# Altium schematic sheet FPGA.SchDoc: =DocumentName
size A4; DocumentNumber: 1; Revision: 0; SheetNumber: 14; SheetTotal: 18
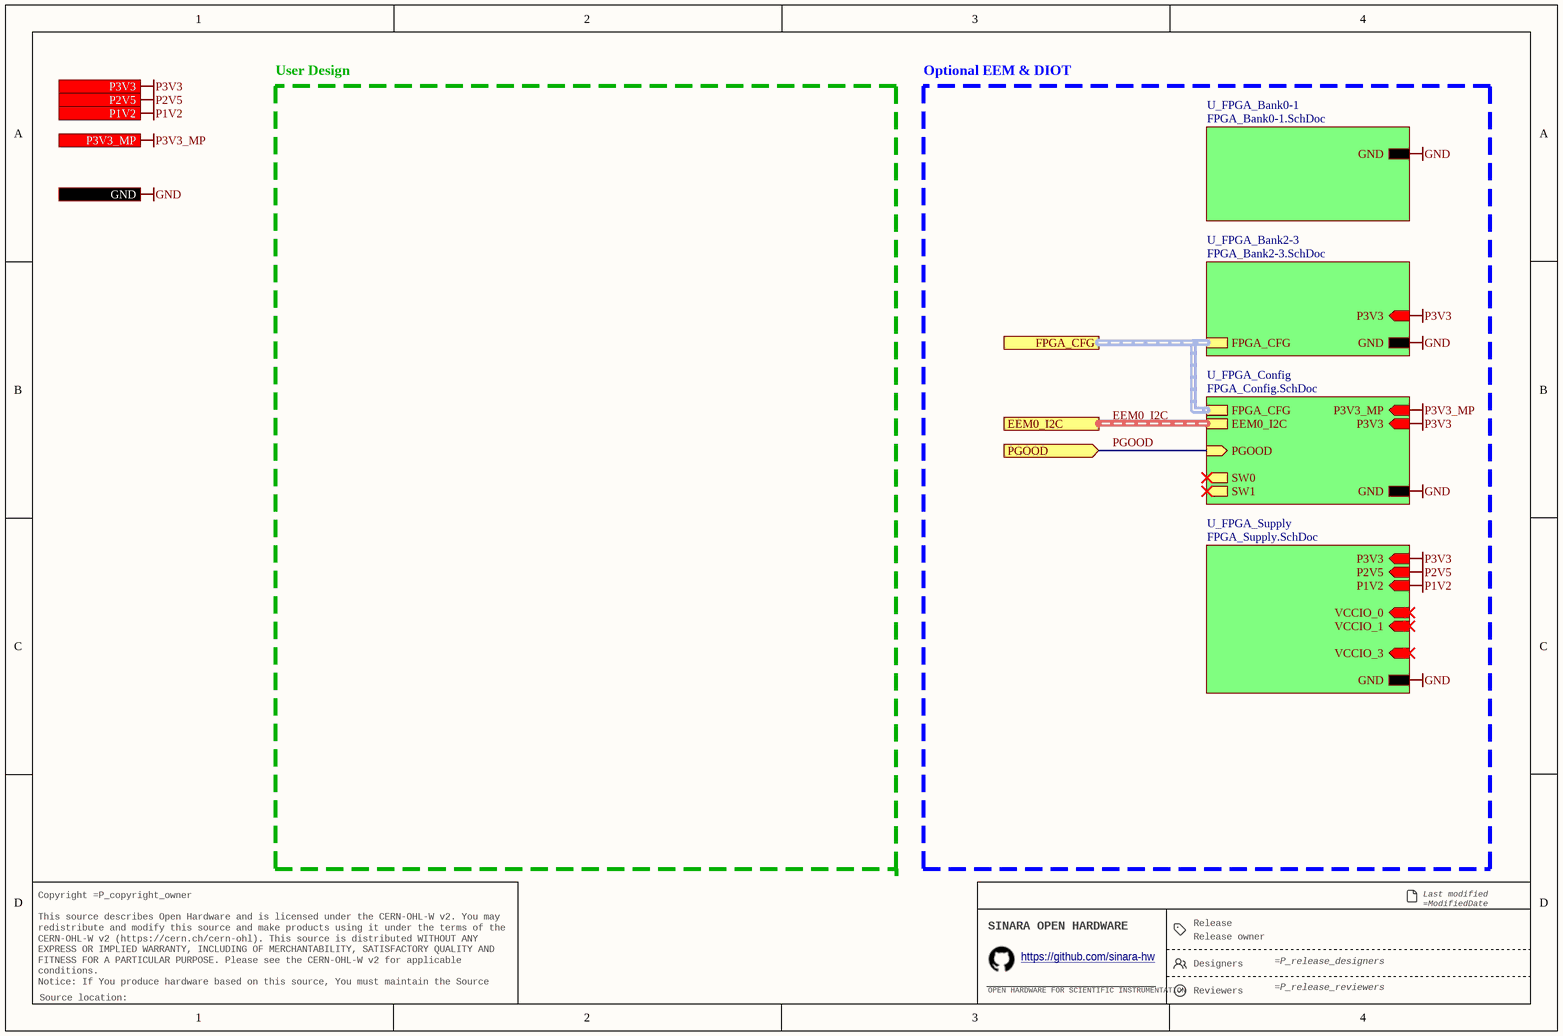
[diagram p0: FPGA.SchDoc]

## Sub-sheets
U_FPGA_Bank0-1 = FPGA_Bank0-1.SchDoc: GND
U_FPGA_Bank2-3 = FPGA_Bank2-3.SchDoc: GND, P3V3 (in), FPGA_CFG (harness FPGA_CFG)
U_FPGA_Config = FPGA_Config.SchDoc: FPGA_CFG (harness FPGA_CFG), EEM0_I2C (harness I2C), P3V3_MP (in), P3V3 (in), GND, PGOOD (in), SW0 (out), SW1 (out)
U_FPGA_Supply = FPGA_Supply.SchDoc: P3V3 (in), P1V2 (in), VCCIO_0 (in), P2V5 (in), VCCIO_1 (in), VCCIO_3 (in), GND

## Ports
EEM0_I2C (harness I2C), FPGA_CFG (harness FPGA_CFG), GND, P1V2 (in), P2V5 (in), P3V3 (in), P3V3_MP (in), PGOOD (in)

## Nets
GND: port GND, sheet U_FPGA_Bank0-1/GND, sheet U_FPGA_Bank2-3/GND, sheet U_FPGA_Supply/GND, sheet U_FPGA_Config/GND
P1V2: port P1V2, sheet U_FPGA_Supply/P1V2
P2V5: port P2V5, sheet U_FPGA_Supply/P2V5
P3V3: port P3V3, sheet U_FPGA_Bank2-3/P3V3, sheet U_FPGA_Supply/P3V3, sheet U_FPGA_Config/P3V3
P3V3_MP: port P3V3_MP, sheet U_FPGA_Config/P3V3_MP
PGOOD: port PGOOD, sheet U_FPGA_Config/PGOOD

## Buses and harness runs
harness EEM0_I2C = port EEM0_I2C = sheet U_FPGA_Config/EEM0_I2C
harness port FPGA_CFG = sheet U_FPGA_Bank2-3/FPGA_CFG = sheet U_FPGA_Config/FPGA_CFG

## Notes on the sheet
- User Design
- Optional EEM & DIOT
- VCCIO_2 = P3V3
- Release
- Last modified =ModifiedDate
  Sheet =sheetnumber of =sheettotal · Size A4
- Copyright =P_copyright_owner
  This source describes Open Hardware and is licensed under the CERN-OHL-W v2. You may redistribute and modify this source and make products using it under the terms of the CERN-OHL-W v2 (https://cern.ch/cern-ohl). This source is distributed WITHOUT ANY EXPRESS OR IMPLIED WARRANTY, INCLUDING OF MERCHANTABILITY, SATISFACTORY QUALITY AND FITNESS FOR A PARTICULAR PURPOSE. Please see the CERN-OHL-W v2 for applicable conditions.
  Notice: If You produce hardware based on this source, You must maintain the Source Location visible on the product, its packaging or its documentation.
- SINARA OPEN HARDWARE
- OPEN HARDWARE FOR SCIENTIFIC INSTRUMENTATION
- https://github.com/sinara-hw
- Release owner
- Designers
- Reviewers
- Source location: